# EAGLE design pilight_sys (EAGLE 9.3.1)
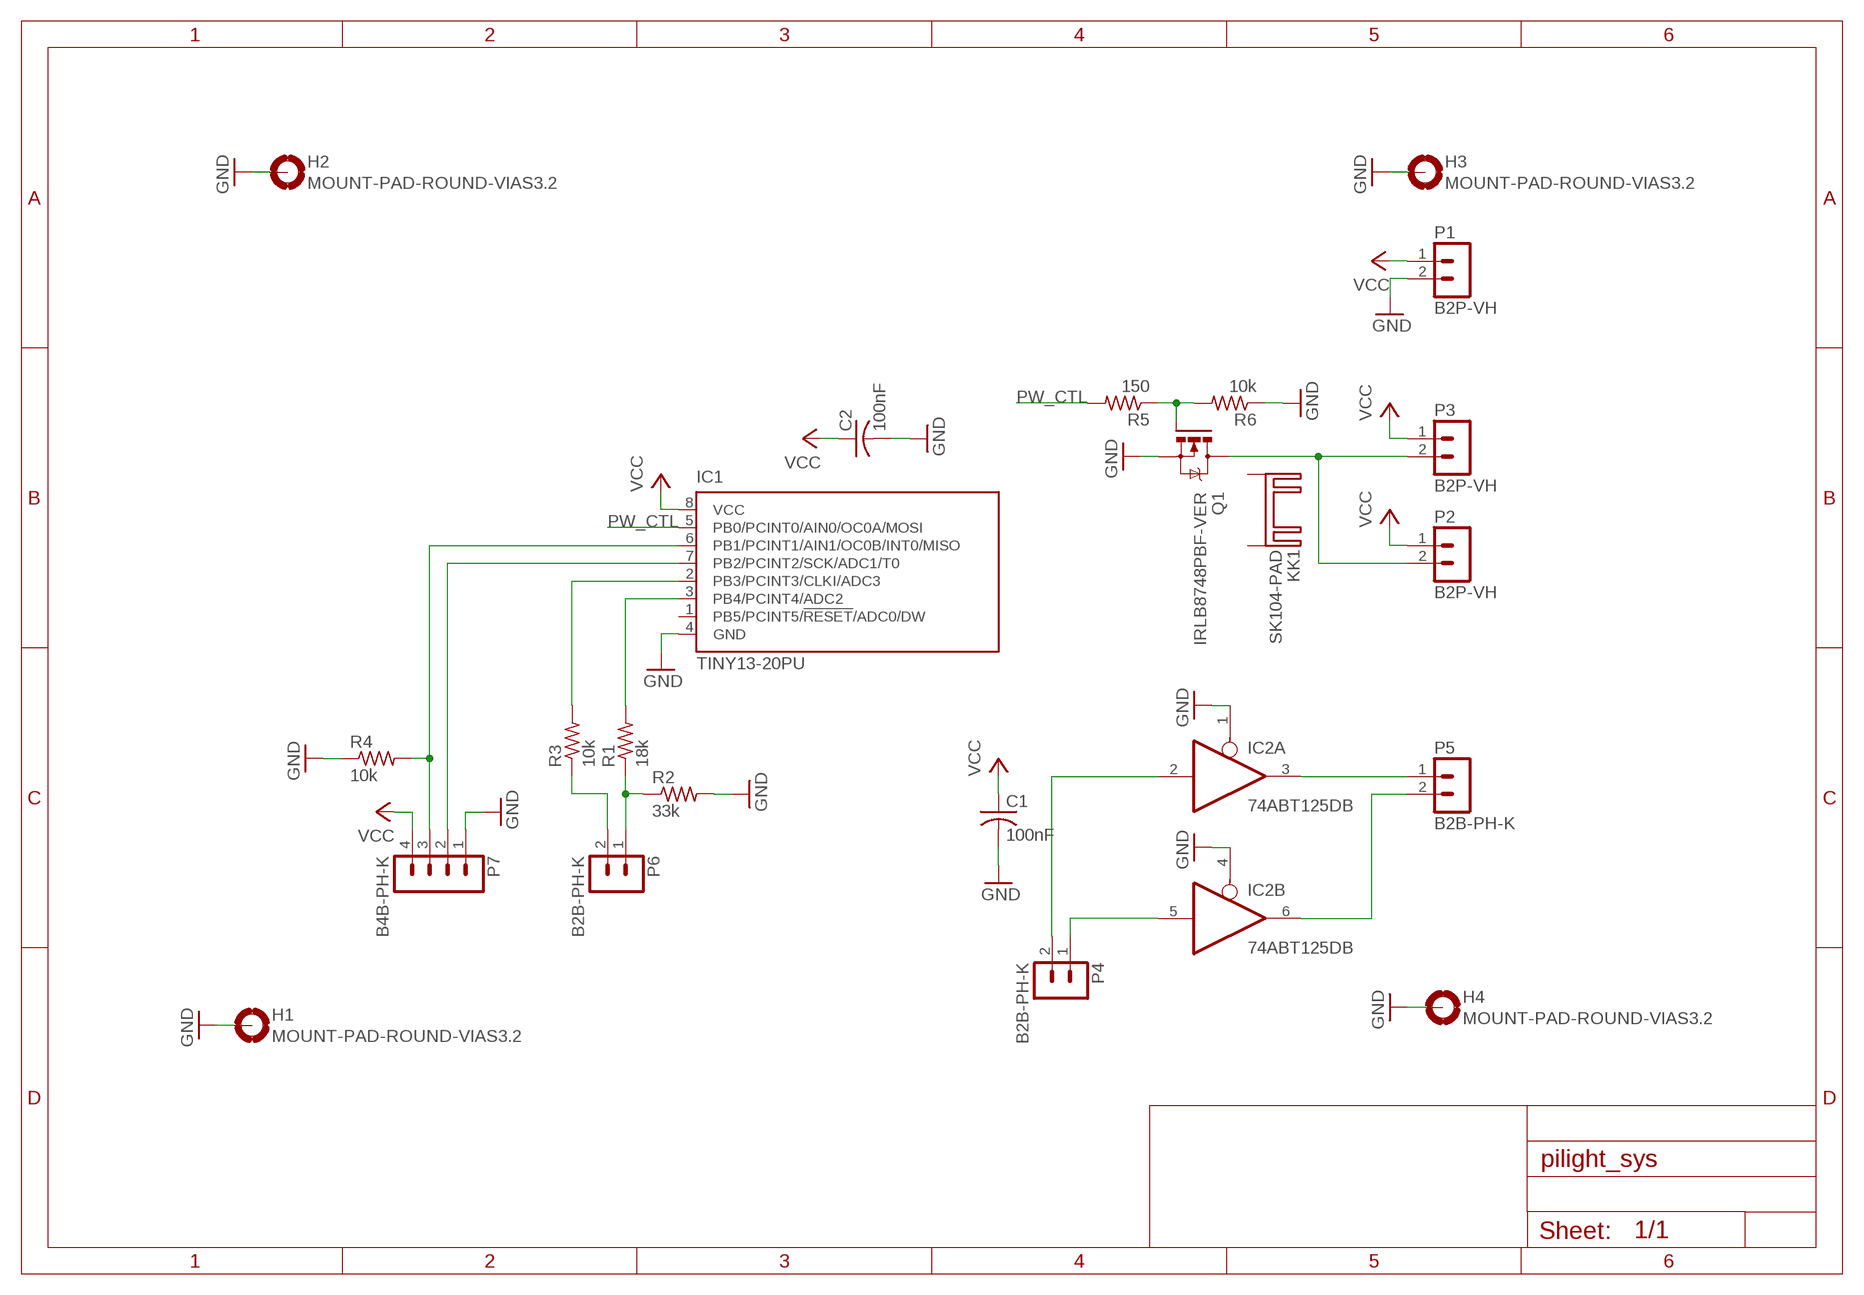
[diagram p0: schematic, sheet 1]

## Parts
C1  100nF  C-USC0805  [C0805]
C2  100nF  C-USC0805  [C0805]
H1  MOUNT-PAD-ROUND-VIAS3.2  [3,2-PAD]
H2  MOUNT-PAD-ROUND-VIAS3.2  [3,2-PAD]
H3  MOUNT-PAD-ROUND-VIAS3.2  [3,2-PAD]
H4  MOUNT-PAD-ROUND-VIAS3.2  [3,2-PAD]
IC1  TINY13-20PU  [DIL08]
IC2  74ABT125DB  [SSOP14]
KK1  SK104-PAD  [SK104-PAD]
P1  B2P-VH  [B2P-VH]
P2  B2P-VH  [B2P-VH]
P3  B2P-VH  [B2P-VH]
P4  B2B-PH-K  [B2B-PH-K]
P5  B2B-PH-K  [B2B-PH-K]
P6  B2B-PH-K  [B2B-PH-K]
P7  B4B-PH-K  [B4B-PH-K]
Q1  IRLB8748PBF-VER  [TO220AV]
R1  18k  R-US_R0805  [R0805]
R2  33k  R-US_R0805  [R0805]
R3  10k  R-US_R0805  [R0805]
R4  10k  R-US_R0805  [R0805]
R5  150  R-US_R0805  [R0805]
R6  10k  R-US_R0805  [R0805]

## Nets
GND: C1.2 C2.2 H1.B3,2(MOUNT) H1.P$1(MOUNT) H1.P$2(MOUNT) H1.P$3(MOUNT) H1.P$4(MOUNT) H1.P$5(MOUNT) H1.P$6(MOUNT) H1.P$7(MOUNT) H1.P$8(MOUNT) H1.P$9(MOUNT) H2.B3,2(MOUNT) H2.P$1(MOUNT) H2.P$2(MOUNT) H2.P$3(MOUNT) H2.P$4(MOUNT) H2.P$5(MOUNT) H2.P$6(MOUNT) H2.P$7(MOUNT) H2.P$8(MOUNT) H2.P$9(MOUNT) H3.B3,2(MOUNT) H3.P$1(MOUNT) H3.P$2(MOUNT) H3.P$3(MOUNT) H3.P$4(MOUNT) H3.P$5(MOUNT) H3.P$6(MOUNT) H3.P$7(MOUNT) H3.P$8(MOUNT) H3.P$9(MOUNT) H4.B3,2(MOUNT) H4.P$1(MOUNT) H4.P$2(MOUNT) H4.P$3(MOUNT) H4.P$4(MOUNT) H4.P$5(MOUNT) H4.P$6(MOUNT) H4.P$7(MOUNT) H4.P$8(MOUNT) H4.P$9(MOUNT) IC1.4(GND) IC2.1(A:OE) IC2.4(B:OE) P1.2 P7.1 Q1.S R2.2 R4.1 R6.1
N$1: IC2.5(B:I) P4.1
N$2: IC2.2(A:I) P4.2
N$3: IC2.3(A:O) P5.1
N$4: IC2.6(B:O) P5.2
N$5: P2.2 P3.2 Q1.D
N$6: P6.1 R1.1 R2.1
N$7: P6.2 R3.1
N$8: IC1.6(PB1/PCINT1/AIN1/OC0B/INT0/MISO) P7.3 R4.2
N$9: Q1.G R5.1 R6.2
N$11: IC1.3(PB4/PCINT4/ADC2) R1.2
N$12: IC1.2(PB3/PCINT3/CLKI/ADC3) R3.2
N$13: IC1.7(PB2/PCINT2/SCK/ADC1/T0) P7.2
PW_CTL: IC1.5(PB0/PCINT0/AIN0/OC0A/MOSI) R5.2
VCC: C1.1 C2.1 IC1.8(VCC) P1.1 P2.1 P3.1 P7.4
Unconnected: IC1.1(PB5/PCINT5/!RESET!/ADC0/DW) IC2.8(C:O) IC2.9(C:I) IC2.10(C:OE) IC2.11(D:O) IC2.12(D:I) IC2.13(D:OE) KK1.K1(K) KK1.K2(K)

## Power pins joined to a net without a drawn wire
GND: IC2.7(P:GND)
VCC: IC2.14(P:VCC)

## Library data of the parts
C1 C2 = resistor:C-US: CAPACITOR, American symbol
H1-H4 = my_library:MOUNT-PAD-ROUND-VIAS: MOUNTING PAD, round
IC1 = atmel:TINY13: 8-bit AVR Microcontroller with 1K Bytes In-System Programmable Flash Source: http://www.atmel.com/dyn/resources/prod_documents/2535S.pdf; MPN: ATTINY13-20PU; OC_FARNELL: 9171550; OC_NEWARK: 96K6521
IC2 = 74xx-us:74*125: Quad bus BUFFER, 3-state
KK1 = heatsink:SK104-PAD: HEATSINK manufacturer Fischer/distributor Buerklin
P1-P3 = con-jst-vh:B2P-VH: HEADER
P4-P6 = con-jst-ph:B2B-PH-K: HEADER
P7 = con-jst-ph:B4B-PH-K: HEADER
Q1 = my_library:IRLB8748PBF-VER: N-Channel HEXFET® Power MOSFET Logic Level Optimized for UPS/Inverter Applications High Frequency Synchronous Buck High Frequency Isolated DC-DC Converters with Synchronous Rectification for Telecom and Industrial use
R1-R6 = resistor:R-US_: RESISTOR, American symbol

## Board
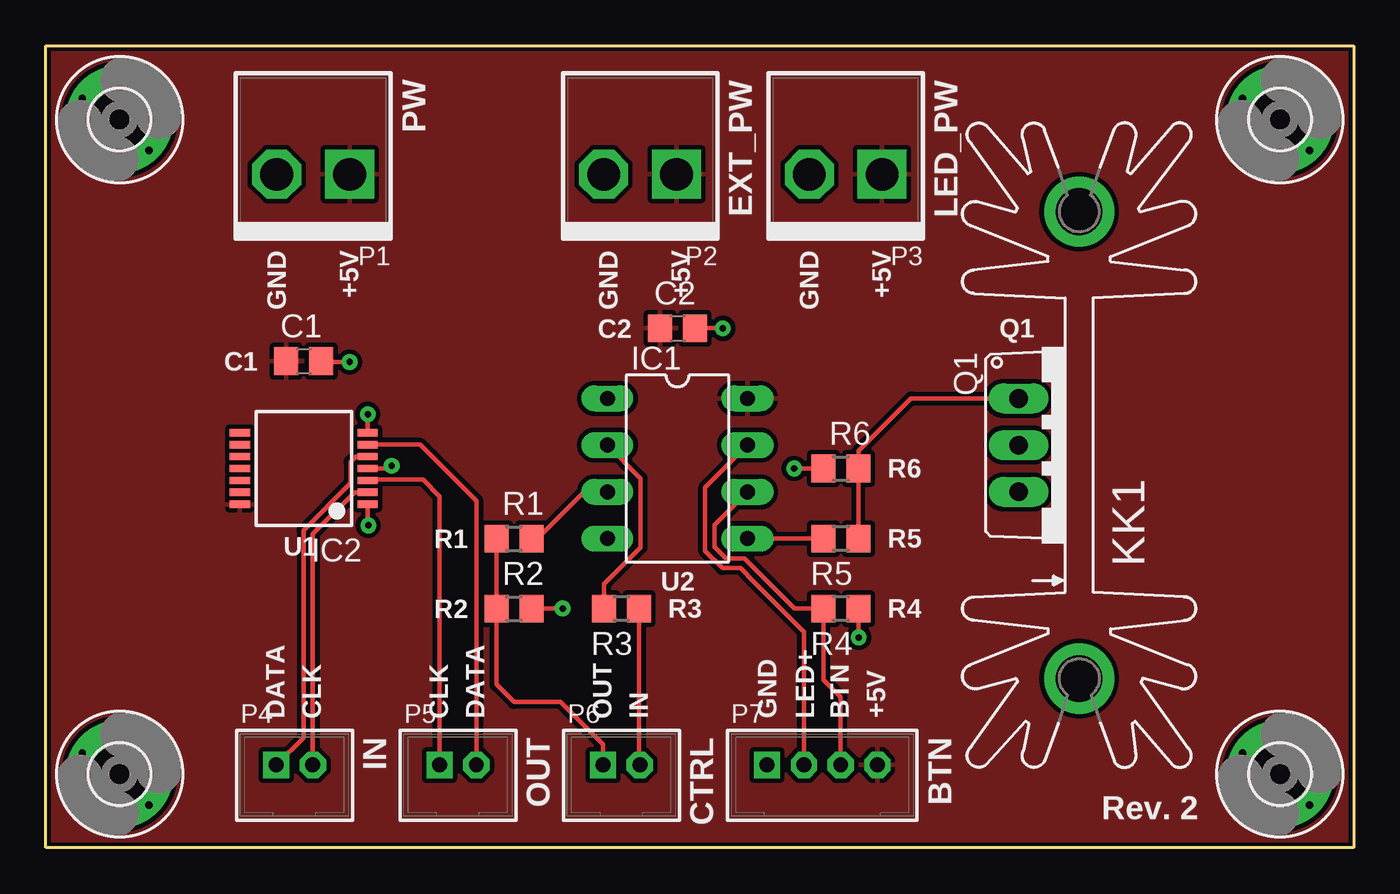
[diagram p1: board, top side]
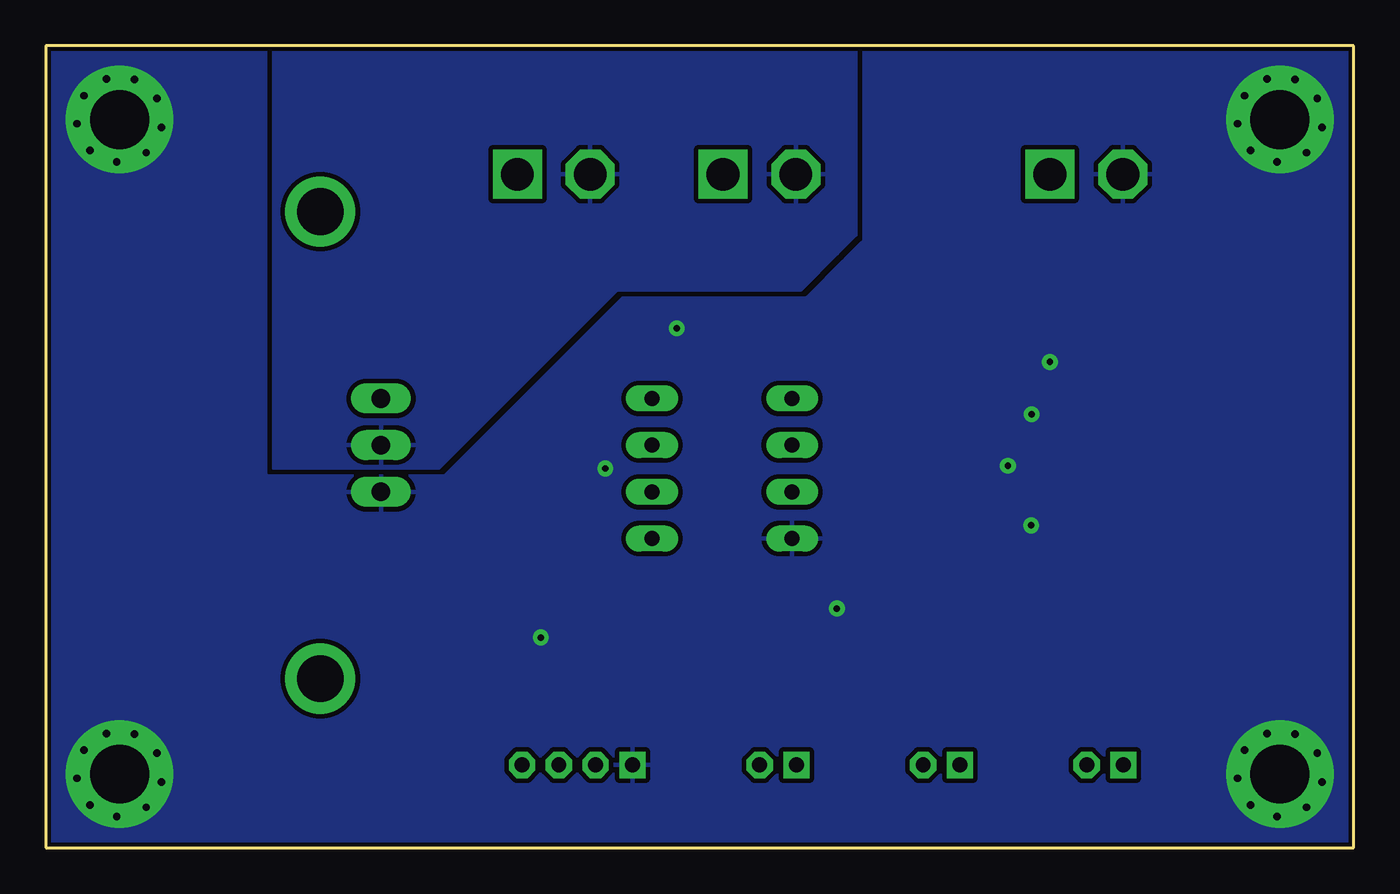
[diagram p2: board, bottom side, seen from below]

Size 71.1 x 43.6 mm. Coordinates in mm from the lower left corner, seen from the top.
Outline: 0,0 0,43.6 71.1,43.6 71.1,0 0,0
Copper layers (1*16): Top 0.035mm / dielectric 1.5mm / Bottom 0.035mm
Design rules "gma *": minimum track width 10mil, minimum drill 13mil, track to track 10mil, track to pad 10mil, pad to pad 8mil, via to via 10mil, smd to smd 8mil, copper to edge 8mil, drill to drill 8mil, minimum pad ring 12mil, minimum via ring 10mil, stop-mask expansion 4mil, vias tented up to drill 23mil, thermal gap 10mil

### Footprints (pad centres in the part's own frame; a part is rotated, then mirrored left to right if it is on the bottom)
C0805 = smd 1.3 x 1.5: 1 -0.95,0; 2 0.95,0
3,2-PAD = drill 3.2 pad 5.842: B3,2 0,0 | drill 0.4: P$1 -0.813,2.184; P$2 0.711,2.21; P$3 1.93,1.295; P$4 2.311,-0.229; P$5 1.6,-1.676; P$6 0.152,-2.311; P$7 -1.448,-1.803; P$8 -2.286,-0.432; P$9 -2.032,1.143
DIL08 = drill 0.813 long: 1 -3.81,-3.81; 2 -1.27,-3.81; 3 1.27,-3.81; 4 3.81,-3.81; 5 3.81,3.81; 6 1.27,3.81; 7 -1.27,3.81; 8 -3.81,3.81
SSOP14 = smd 0.4 x 1.1: 1 -1.95,-3.475; 2 -1.3,-3.475; 3 -0.65,-3.475; 4 0,-3.475; 5 0.65,-3.475; 6 1.3,-3.475; 7 1.95,-3.475; 8 1.95,3.475; 9 1.3,3.475; 10 0.65,3.475; 11 0,3.475; 12 -0.65,3.475; 13 -1.3,3.475; 14 -1.95,3.475
SK104-PAD = drill 2.54 pad 3.81: K1 -12.7,-0.762; K2 12.7,-0.762
B2P-VH = drill 1.778 square: 1 -1.98,0 | drill 1.778 octagon: 2 1.98,0
B2B-PH-K = drill 0.813 square: 1 -1,0 | drill 0.813 octagon: 2 1,0
B4B-PH-K = drill 0.813 square: 1 -3,0 | drill 0.813 octagon: 2 -1,0; 3 1,0; 4 3,0
TO220AV = drill 1.016 long: D 0,-2.54; G -2.54,-2.54; S 2.54,-2.54
R0805 = smd 1.3 x 1.5: 1 -0.95,0; 2 0.95,0

### Placement (x,y rotation side)
C1  14.02,26.46 0 top
C2  34.34,28.25 0 top
H1  4,39.6 0 top
H2  67.1,39.6 0 top
H3  4,4 0 top
H4  67.1,4 0 top
IC1  34.34,20.62 270 top
IC2  14.02,20.62 90 top
KK1  55.42,21.89 90 top
P1  14.53,36.62 180 top
P2  32.31,36.62 180 top
P3  43.48,36.62 180 top
P4  13.51,4.49 0 top
P5  22.4,4.49 0 top
P6  31.29,4.49 0 top
P7  42.21,4.49 0 top
Q1  55.42,21.89 270 top
R1  25.45,16.81 0 top
R2  25.45,13 0 top
R3  31.29,13 180 top
R4  43.23,13 180 top
R5  43.23,16.81 180 top
R6  43.23,20.62 0 top

### Tracks (layer width: path | path; a pad name or v marks a point on that pad's centre or on a via)
GND  (via drill 0.35)
  Top 0.254: R6.1 v40.69,20.62 | IC2.7 v17.5,23.56 v17.5,23.57 | R4.1 44.18,11.45 v44.2,11.43 | R2.2 v28.09,13 v28.09,13.01 | C1.2 15.02,26.42 v16.51,26.42 | C2.2 v36.8,28.25 | IC2.1 17.5,17.56 v17.53,17.53 | IC2.4 18.65,20.62 v18.8,20.77
  pour Bottom (rank 2): 0,43.6 0,0 71.1,0 71.1,43.6
N$1
  Top 0.254: IC2.5 16.86,21.27 16.56,20.98 16.56,19.82 14,17.26 14,5.98 P4.1
N$2
  Top 0.254: IC2.2 16.78,19.32 14.51,17.05 P4.2
N$3
  Top 0.254: P5.1 21.4,19.11 20.5,20.01 17.54,20.01 IC2.3
N$4
  Top 0.254: P5.2 23.4,18.86 20.34,21.92 IC2.6
N$5
  pour Bottom: 27.05,43.3 27.05,33.3 28.05,32.3 30.05,30.3 40.05,30.3 49.73,20.62 58.72,20.62 58.72,43.6 27.35,43.6
N$6
  Top 0.254: P6.1 30.29,5.62 27.99,7.92 25.45,7.92 24.5,8.87 R2.1 R1.1
N$7
  Top 0.254: R3.1 32.24,4.54 P6.2
N$8
  Top 0.254: P7.3 43.21,8.19 42.28,9.12 R4.2 40.69,13 37.97,15.72 36.99,15.72 36.35,16.36 36.35,17.55 IC1.6
N$9
  Top 0.254: R5.1 R6.2 44.18,21.57 47.04,24.43 Q1.G
N$11
  Top 0.254: R1.2 26.72,16.81 29.26,19.35 IC1.3
N$12
  Top 0.254: IC1.2 32.33,20.09 32.33,16.33 30.34,14.34 R3.2
N$13
  Top 0.254: P7.2 41.21,11.73 38.15,14.79 38.15,14.82 37.76,15.21 36.78,15.21 35.84,16.15 35.84,19.58 IC1.7
PW_CTL
  Top 0.254: IC1.5 R5.2
VCC
  pour Top: 0,43.6 71.1,43.6 71.1,0 0,0

### Text on the board
tPlace: PW | EXT_PW | LED_PW | GND | +5V | GND | +5V | GND | +5V | C2 | Q1 | C1 | R6 | U1 | R1 | R5 | U2 | R2 | R3 | R4 | DATA | CLK | CLK | DATA | OUT | IN | GND | LED+ | BTN | +5V | IN | OUT | CTRL | BTN | Rev. 2